# EAGLE design otamatone (EAGLE 8.6.3)
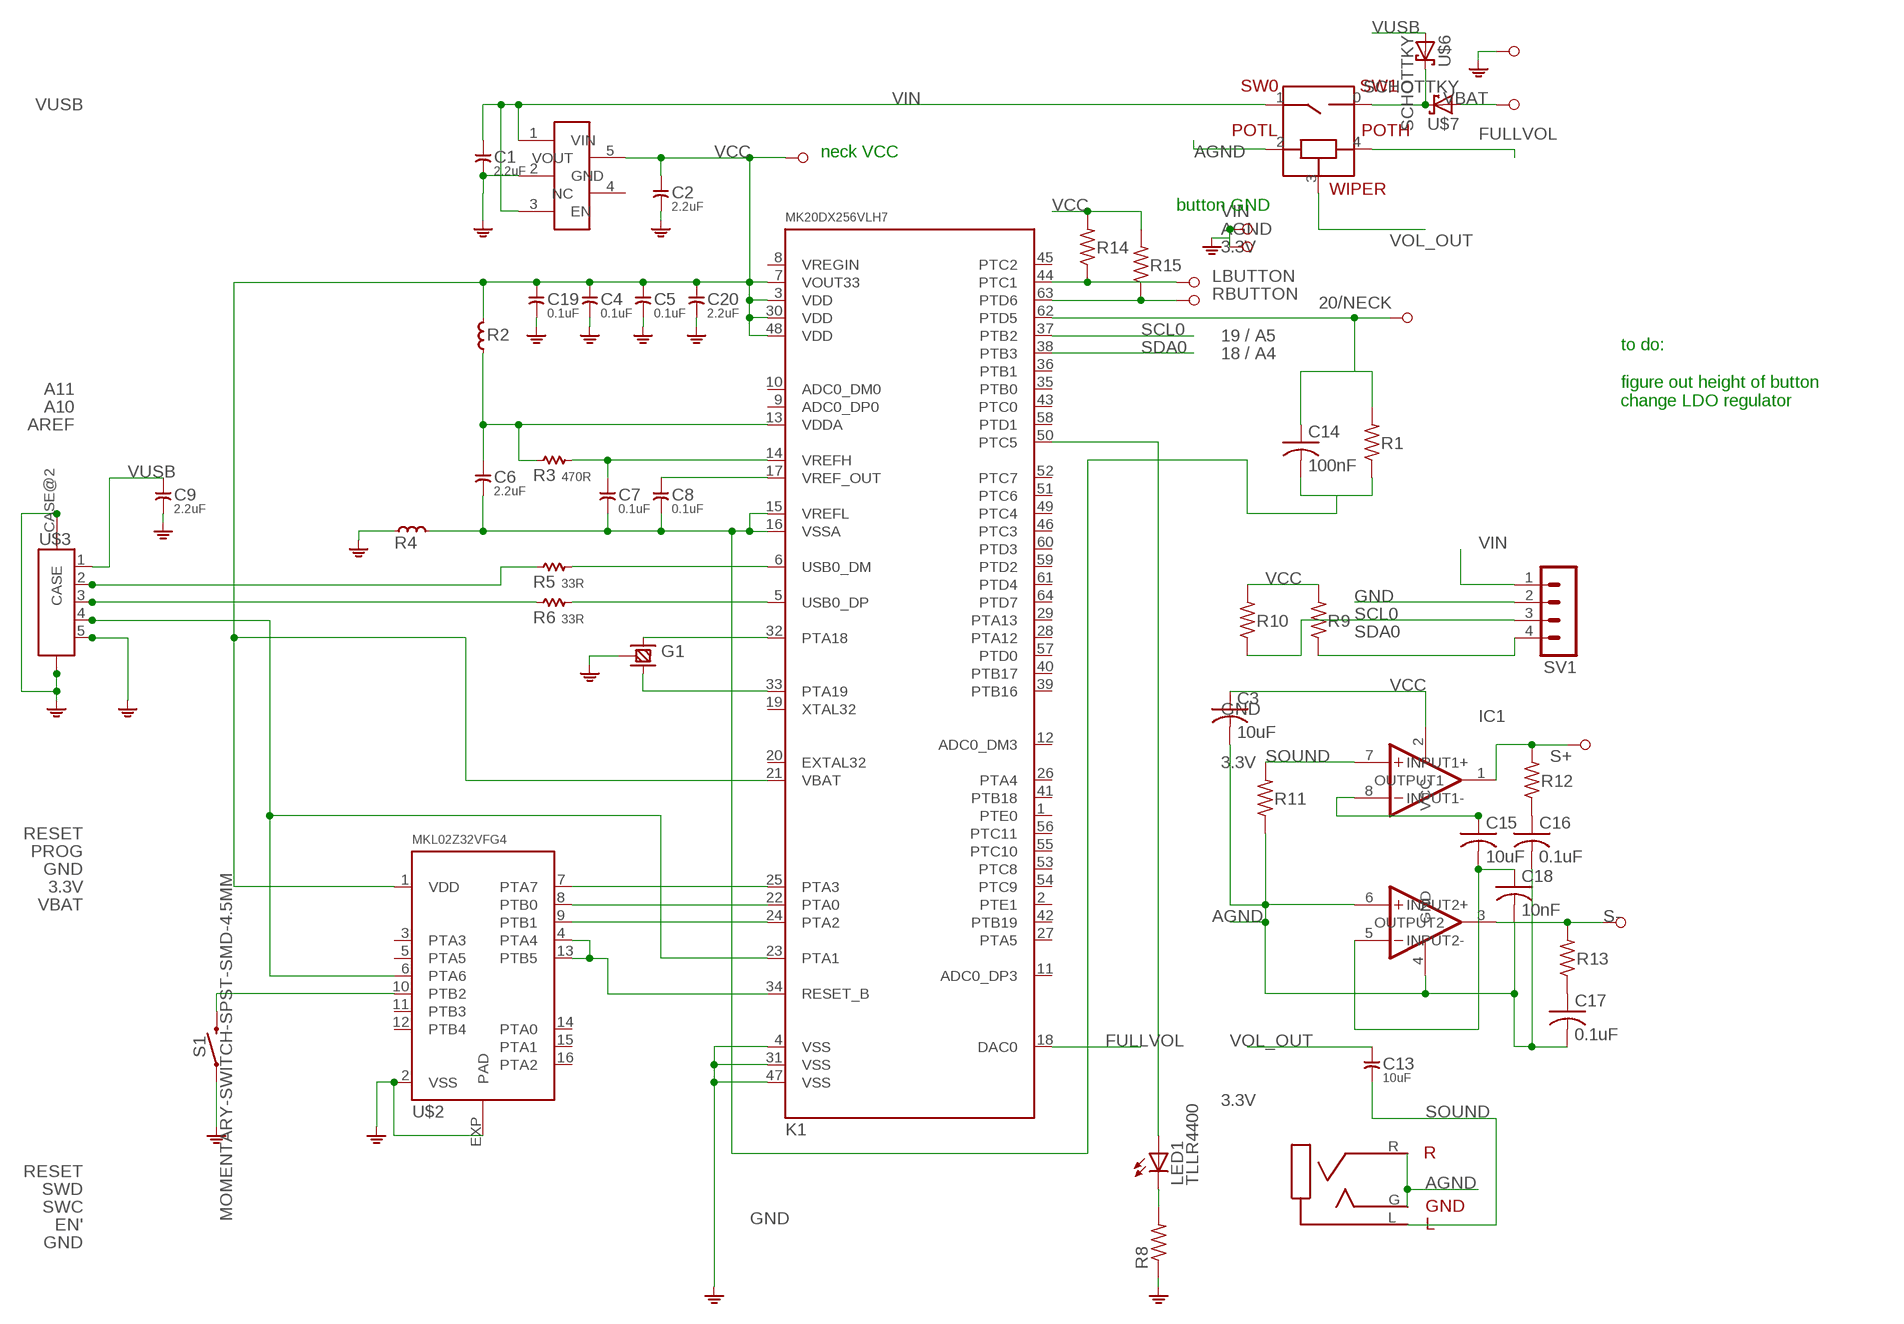
[diagram p0: schematic, sheet 1]

## Parts
B+  PIN  [PTH_39MIL]
B-  PIN  [PTH_39MIL]
C1  2.2uF  CAPACITOR-2.2UF  [C0603]
C2  2.2uF  CAPACITOR-2.2UF  [C0603]
C3  10uF  C-USC0603  [C0603]
C4  0.1uF  CAPACITOR-0.1UF  [C0402]
C5  0.1uF  CAPACITOR-0.1UF  [C0402]
C6  2.2uF  CAPACITOR-2.2UF  [C0603]
C7  0.1uF  CAPACITOR-0.1UF  [C0402]
C8  0.1uF  CAPACITOR-0.1UF  [C0402]
C9  2.2uF  CAPACITOR-2.2UF  [C0603]
C13  10uF  CAPACITOR-22PF  [C0603]
C14  100nF  C-USC0402  [C0402]
C15  10uF  C-USC0603  [C0603]
C16  0.1uF  C-USC0603  [C0603]
C17  0.1uF  C-USC0603  [C0603]
C18  10nF  C-USC0603  [C0603]
C19  0.1uF  CAPACITOR-0.1UF  [C0402]
C20  2.2uF  CAPACITOR-2.2UF  [C0603]
G1  CRYSTAL-  [CRYS]
IC1  TDA2822MSOP8  [SOP8]
K1  MK20DX256VLH7  [LQFP64-05]
LED1  TLLR4400  [LED3MM]
R1  62K  R-US_R0402  [R0402]
R2  FERRITE  [L0603]
R3  470R  RESISTOR-470R  [R0402]
R4  FERRITE  [L0603]
R5  33R  RESISTOR-33R  [R0402]
R6  33R  RESISTOR-33R  [R0402]
R8  R-US_R0603  [R0603]
R9  10K  R-US_R0402  [R0402]
R10  10K  R-US_R0402  [R0402]
R11  10K  R-US_R0603  [R0603]
R12  4.7  R-US_R0603  [R0603]
R13  4.7  R-US_R0603  [R0603]
R14  10K  R-US_R0402  [R0402]
R15  10K  R-US_R0402  [R0402]
S1  MOMENTARY-SWITCH-SPST-SMD-4.5MM  [TACTILE_SWITCH_SMD_4.5MM]
S+  PINSMT  [SMD]
S-  PINSMT  [SMD]
SV1  MA04-1  [MA04-1]
SX1  PIN  [PTH_39MIL]
SX2  PIN  [PTH_39MIL]
SX3  PIN  [PTH_39MIL]
SX4  PIN  [PTH_39MIL]
U$1  P170S  [5PIN_POT]
U$2  MKL02Z32VFG4  [QFN16]
U$3  VERT_USB  [TALL_BOI]
U$4  VERT_JACK  [AUDIOJACK]
U$5  AP2112K  [SOT25]
U$6  SCHOTTKY  [LED-0805]
U$7  SCHOTTKY  [LED-0805]
Z+  PINSMT  [SMD]
Z-  PINSMT  [SMD]

## Nets
20/NECK: C14.1 K1.62(PTD5) R1.2 Z-.P$1
AGND: C3.2 C6.2 C7.2 C8.2 C14.2 C16.2 C17.2 C18.2 IC1.4(GND) IC1.6(INPUT2+) K1.15(VREFL) K1.16(VSSA) R1.1 R4.2 R11.1 U$1.2(POTL) U$4.G(GND) U$4.R
FULLVOL: K1.18(DAC0) U$1.4(POTH)
GND: B-.1 C1.2 C2.2 C4.2 C5.2 C9.2 C19.2 C20.2 G1.P$1(GND) G1.P$4(GND) K1.4(VSS) K1.31(VSS) K1.47(VSS) R4.1 R8.1 S1.2 S1.3 SV1.2 SX1.1 SX3.1 U$2.2(VSS) U$2.EXP(PAD) U$3.5 U$3.CASE U$3.CASE@2(CASE) U$5.2(GND)
LBUTTON: K1.44(PTC1) R14.1 SX2.1
N$1: U$1.0(SW1) U$6.-(C) U$7.-(C)
N$2: K1.22(PTA0) U$2.8(PTB0)
N$3: K1.24(PTA2) U$2.9(PTB1)
N$5: G1.P$2 K1.32(PTA18)
N$6: G1.P$3 K1.33(PTA19)
N$7: C15.1 IC1.8(INPUT1-)
N$8: K1.25(PTA3) U$2.7(PTA7)
N$9: S1.1 S1.4 U$2.10(PTB2)
N$11: C8.1 K1.17(VREF_OUT)
N$12: K1.34(RESET_B) U$2.4(PTA4) U$2.13(PTB5)
N$13: C7.1 K1.14(VREFH) R3.2
N$15: C6.1 K1.13(VDDA) R2.1 R3.1
N$18: C16.1 R12.1
N$19: K1.23(PTA1) U$2.6(PTA6) U$3.4
N$21: C17.1 R13.1
N$22: C15.2 C18.1 IC1.5(INPUT2-)
N$31: K1.50(PTC5) LED1.A
N$52: LED1.K(C) R8.2
RBUTTON: K1.63(PTD6) R15.1 SX4.1
S+: IC1.1(OUTPUT1) R12.2 S+.P$1
S-: IC1.3(OUTPUT2) R13.2 S-.P$1
SCL0: K1.37(PTB2) R10.1 SV1.3
SDA0: K1.38(PTB3) R9.1 SV1.4
SOUND: C13.2 IC1.7(INPUT1+) R11.2 U$4.L
USB0_DM: K1.6(USB0_DM) R5.2
USB0_DP: K1.5(USB0_DP) R6.2
USB_M: R5.1 U$3.2
USB_P: R6.1 U$3.3
VBAT: B+.1 U$7.+(A)
VCC: C2.1 C3.1 C4.1 C5.1 C19.1 C20.1 IC1.2(VCC) K1.3(VDD) K1.7(VOUT33) K1.21(VBAT) K1.30(VDD) K1.48(VDD) R2.2 R9.2 R10.2 R14.2 R15.2 U$2.1(VDD) U$5.5(VOUT) Z+.P$1
VIN: C1.1 SV1.1 U$1.1(SW0) U$5.1(VIN) U$5.3(EN)
VOL_OUT: C13.1 U$1.3(WIPER)
VUSB: C9.1 U$3.1 U$6.+(A)
Unconnected: K1.1(PTE0) K1.2(PTE1) K1.8(VREGIN) K1.9(ADC0_DP0) K1.10(ADC0_DM0) K1.11(ADC0_DP3) K1.12(ADC0_DM3) K1.19(XTAL32) K1.20(EXTAL32) K1.26(PTA4) K1.27(PTA5) K1.28(PTA12) K1.29(PTA13) K1.35(PTB0) K1.36(PTB1) K1.39(PTB16) K1.40(PTB17) K1.41(PTB18) K1.42(PTB19) K1.43(PTC0) K1.45(PTC2) K1.46(PTC3) K1.49(PTC4) K1.51(PTC6) K1.52(PTC7) K1.53(PTC8) K1.54(PTC9) K1.55(PTC10) K1.56(PTC11) K1.57(PTD0) K1.58(PTD1) K1.59(PTD2) K1.60(PTD3) K1.61(PTD4) K1.64(PTD7) U$2.3(PTA3) U$2.5(PTA5) U$2.11(PTB3) U$2.12(PTB4) U$2.14(PTA0) U$2.15(PTA1) U$2.16(PTA2) U$5.4(NC)

## Notes on the sheet
- VUSB
- neck VCC
- button GND | VIN
- AGND
- 3.3V
- 19 / A5
- 18 / A4
- A11
- A10
- to do:
  
  figure out height of button
  change LDO regulator
- AREF
- GND
- 3.3V
- RESET
- PROG
- GND
- 3.3V
- VBAT
- 3.3V
- RESET
- SWD
- SWC
- EN'
- GND

## Library data of the parts
B+ B- = t32_ref:PIN
C1 C2 C6 C9 C20 = otamatone:CAPACITOR-2.2UF
C3 C14-C18 = rcl:C-US: CAPACITOR, American symbol; SPICEPREFIX: C
C4 C5 C7 C8 C19 = otamatone:CAPACITOR-0.1UF
C13 = t32_ref:CAPACITOR-22PF; DESC: 22pF / 50VDC / C0G (NP0); MF: Vishay / Vitramon; MPN: VJ0603A220JXACW1BC; OC_MOUSER: 77-VJ0603A220JXACBC; PACKAGE: 0603; TYPE: Capacitor; VALUE: 22pF
G1 = otamatone:CRYSTAL-
IC1 = TDA2822M:TDA2822M: TDA2822M - DUAL LOW-VOLTAGE POWER AMPLIFIER
K1 = t32_ref:MK20DX256VLH7; DESC: MK20DX256VLH7; MF: NXP; MPN: MK20DX256VLH7; OC_MOUSER: 841-MK20DX256VLH7; PACKAGE: LQFP-64; TYPE: Microcontroller
LED1 = led:TLLR4400: Low Current (2mA) LED 3 mm Tinted Diffused Package color RED Source: Data sheet <http://www.farnell.com/datasheets/391100.pdf>; MF: VISHAY SEMICONDUCTOR; OC_FARNELL: 1612437
R1 R8-R15 = rcl:R-US_: RESISTOR, American symbol; SPICEPREFIX: R
R2 R4 = otamatone:FERRITE; DESC: 600R / 100MHz; MF: Murata Electronics; MPN: BLM18AG601SN1D; OC_MOUSER: 81-BLM11A601S; PACKAGE: 0603; TYPE: Ferrite
R3 = otamatone:RESISTOR-470R
R5 R6 = otamatone:RESISTOR-33R
S1 = SparkFun-Switches:MOMENTARY-SWITCH-SPST: Momentary Switch (Pushbutton) - SPST Normally-open (NO) SPST momentary switches (buttons, pushbuttons). Variants PTH-12MM - 12mm square, through-hole Momentary Pushbutton Switch - 12mm Square <https://www.sparkfun.com/products/9190> (COM-09190) PTH-6.0MM, PTH-6.0MM-KIT - 6.0mm square, through-hole Mini Pushbutton Switch <https://www.sparkfun.com/products/97> (COM-00097) KIT package intended for soldering kit's - only one side of pads' copper is exposed. PTH-RIGHT-ANGLE-KIT - Right-angle, through-hole Right Angle Tactile Button <https://www.sparkfun.com/products/10791> - Used on SparkFun BigTime Watch Kit <https://www.sparkfun.com/products/11734> SMD-12MM - 12mm square, surface-mount Tactile Button - SMD (12mm) <https://www.sparkfun.com/products/12993> (COM-12993) Used on SparkFun PicoBoard <https://www.sparkfun.com/products/11888> SMD-4.5MM - 4.5mm Square Trackball Switch Used on SparkFun Blackberry Trackballer Breakout <https://www.sparkfun.com/products/13169> SMD-4.6MMX2.8MM - 4.60mm x 2.80mm, surface mount Used on SparkFun SAMD21 Mini Breakout <https://www.sparkfun.com/products/13664> SMD-5.2MM, SMD-5.2-REDUNDANT - 5.2mm square, surface-mount Mini Pushbutton Switch - SMD <https://www.sparkfun.com/products/8720> (COM-08720) Used on Arduino Pro Mini <https://www.sparkfun.com/products/11114> REDUNDANT package connects both switch circuits together SMD-6.0X3.5MM - 6.0 x 3.5mm, surface mount Momentary Reset Switch SMD <https://www.sparkfun.com/products/8229> (COM-08229) SMD-6.2MM-TALL - 6.2mm square, surface mount Tactile Button - SMD (6mm) <https://www.sparkfun.com/products/12992> Used on SparkFun Digital Sandbox <https://www.sparkfun.com/products/12651> SMD-RIGHT-ANGLE - Right-angle, surface mount Used on SparkFun Block for Intel® Edison - Arduino <https://www.sparkfun.com/products/13036>; PROD_ID: SWCH-09213
S+ S- SX1-SX4 Z+ Z- = otamatone:PIN
SV1 = con-lstb:MA04-1: PIN HEADER; OC_FARNELL: unknown; OC_NEWARK: unknown
U$1 = otamatone:P170S
U$2 = otamatone:MKL02Z32VFG4
U$3 = otamatone:VERT_USB
U$4 = otamatone:VERT_JACK
U$5 = otamatone:AP2112K
U$6 U$7 = otamatone:SCHOTTKY

## Board
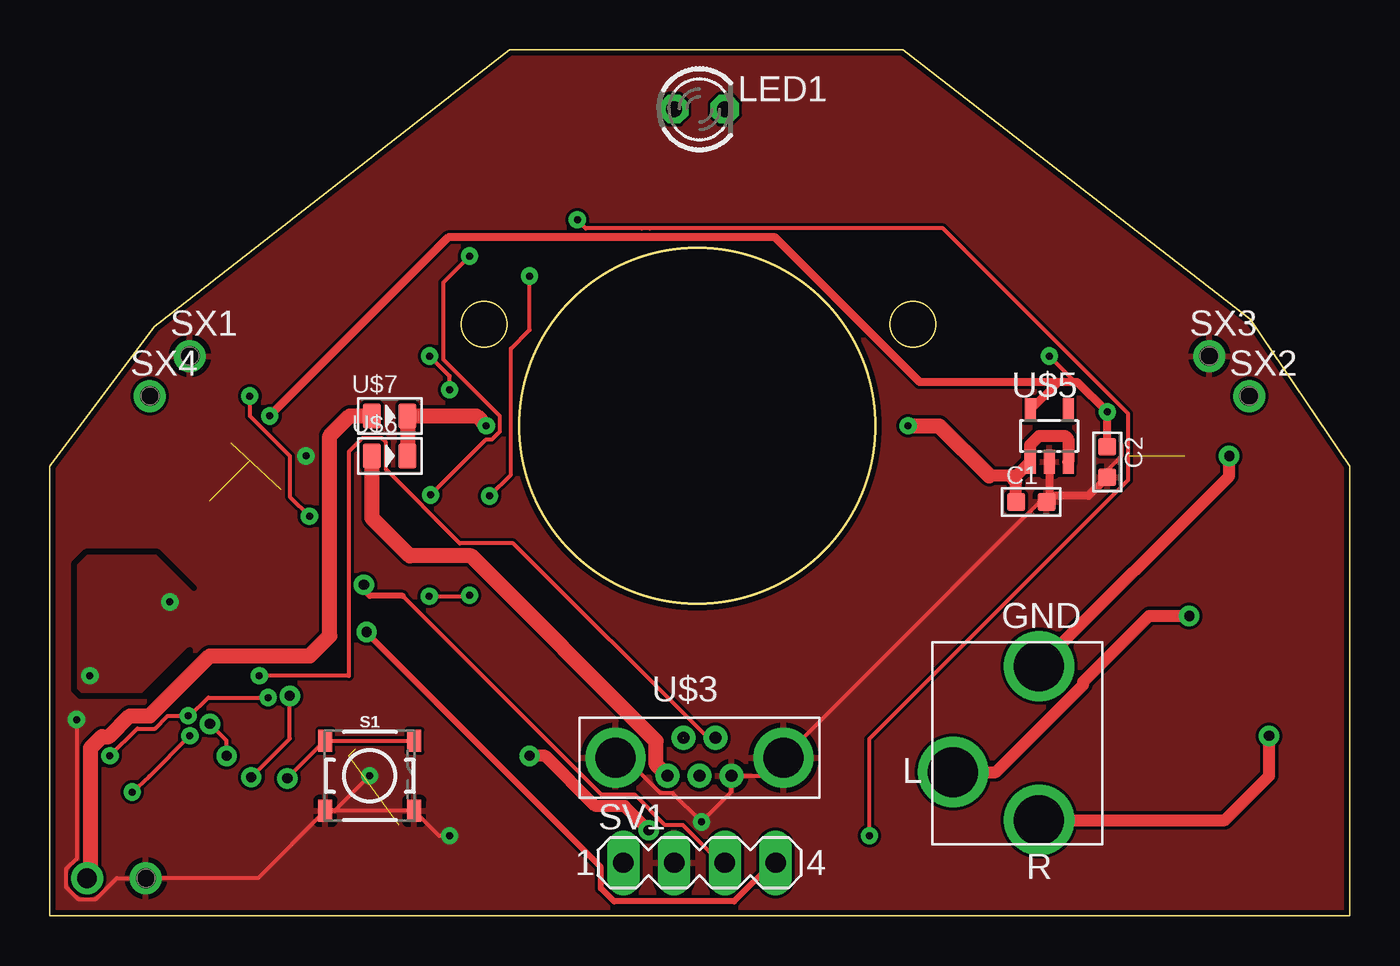
[diagram p1: board, top side]
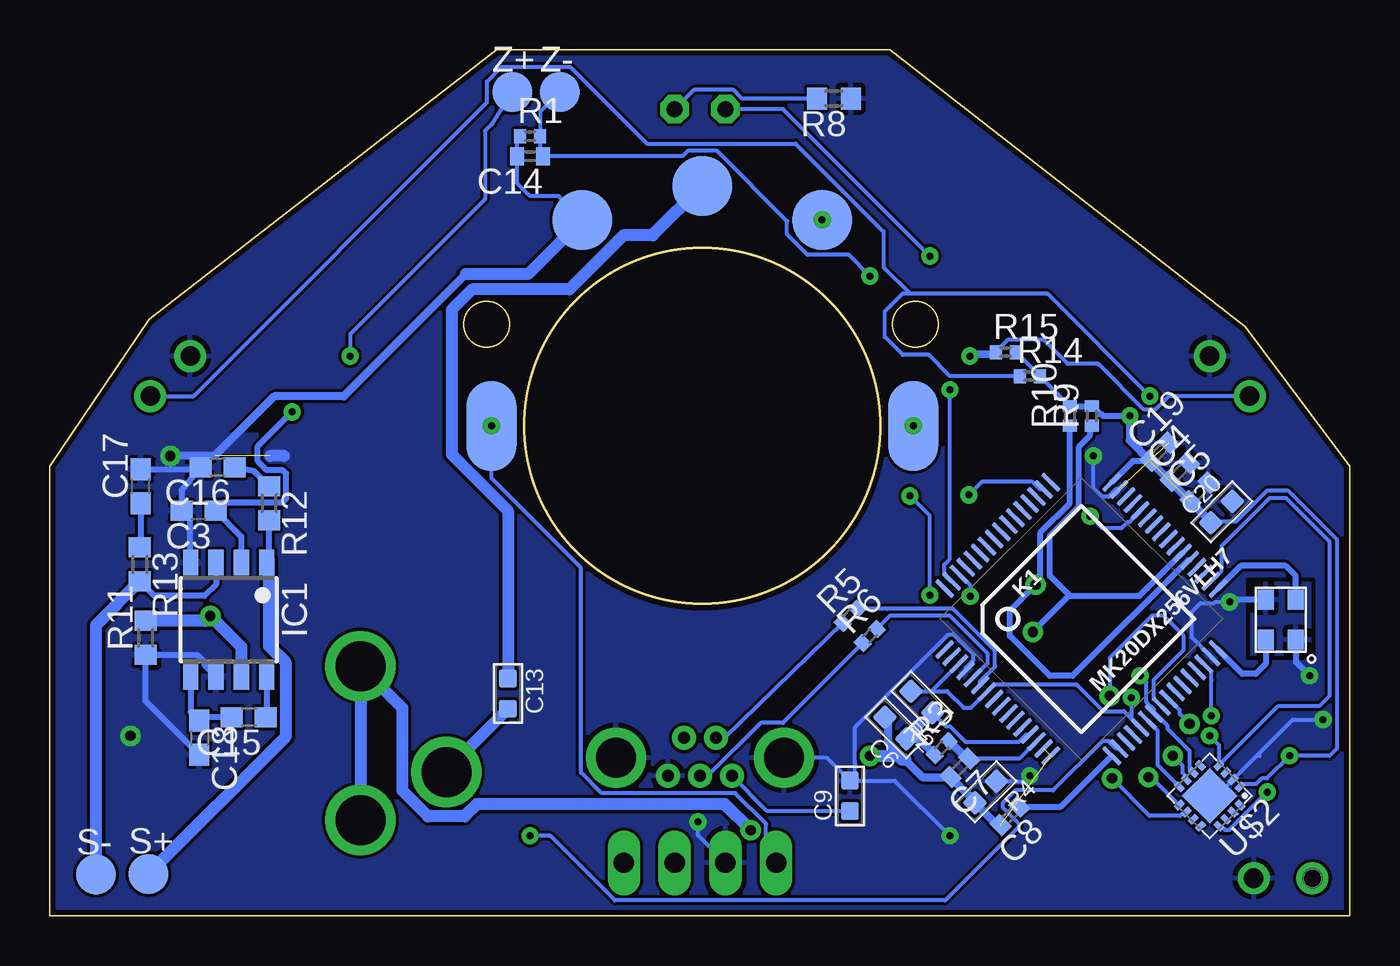
[diagram p2: board, bottom side, seen from below]

Size 65.02 x 43.31 mm. Coordinates in mm from the lower left corner, seen from the top.
Outline: 0,0 65.02,0 65.02,22.48 60.07,29.84 42.67,43.31 22.99,43.31 5.21,29.46 0,22.48 0,0
Outline: circle at 32.38,24.51 radius 8.9
Outline: circle at 21.72,29.59 radius 1.14
Outline: circle at 43.18,29.59 radius 1.14
Copper layers (1*16): Top 0.035mm / dielectric 1.5mm / Bottom 0.035mm
Design rules "SparkFun *": minimum track width 8mil, minimum drill 20mil, track to track 6mil, track to pad 6mil, pad to pad 6mil, via to via 6mil, smd to smd 6mil, copper to edge 10mil, drill to drill 8mil, minimum pad ring 12mil, minimum via ring 10mil, stop-mask expansion 4mil, vias tented up to drill 25mil, thermal gap 10mil
tKeepout: area 41,27.5 to 45.2,31.7; area 19.6,27.5 to 23.8,31.7; area 29.4,37.2 to 35.6,43.4
tRestrict: 7 lines
bRestrict: 4 lines

### Footprints (pad centres in the part's own frame; a part is rotated, then mirrored left to right if it is on the bottom)
PTH_39MIL = drill 0.991: 1 0,0
C0603 = smd 0.889 x 0.889: 1 0,0.762; 2 0,-0.762
C0603' = smd 1.1 x 1: 1 -0.85,0; 2 0.85,0
C0402 = smd 0.7 x 0.9: 1 -0.65,0; 2 0.65,0
CRYS = smd 1 x 0.8: P$1 0.6,0.5; P$2 2.6,0.5; P$3 0.6,2; P$4 2.593,2
SOP8 = smd 0.76 x 1.27: 1 -1.905,-2.86; 2 -0.635,-2.86; 3 0.635,-2.86; 4 1.905,-2.86; 5 1.905,2.86; 6 0.635,2.86; 7 -0.635,2.86; 8 -1.905,2.86
LQFP64-05 = smd 1.2 x 0.25: 1 -5.915,3.759; 2 -5.915,3.251; 3 -5.915,2.743; 4 -5.915,2.261; 5 -5.915,1.753; 6 -5.915,1.245; 7 -5.915,0.762; 8 -5.915,0.254; 9 -5.915,-0.254; 10 -5.915,-0.762; 11 -5.915,-1.245; 12 -5.915,-1.753; 13 -5.915,-2.261; 14 -5.915,-2.743; 15 -5.915,-3.251; 16 -5.915,-3.759; 33 5.915,-3.759; 34 5.915,-3.251; 35 5.915,-2.743; 36 5.915,-2.261; 37 5.915,-1.753; 38 5.915,-1.245; 39 5.915,-0.762; 40 5.915,-0.254; 41 5.915,0.254; 42 5.915,0.762; 43 5.915,1.245; 44 5.915,1.753; 45 5.915,2.261; 46 5.915,2.743; 47 5.915,3.251; 48 5.915,3.759 | smd 0.25 x 1.2: 17 -3.759,-5.915; 18 -3.251,-5.915; 19 -2.743,-5.915; 20 -2.261,-5.915; 21 -1.753,-5.915; 22 -1.245,-5.915; 23 -0.762,-5.915; 24 -0.254,-5.915; 25 0.254,-5.915; 26 0.762,-5.915; 27 1.245,-5.915; 28 1.753,-5.915; 29 2.261,-5.915; 30 2.743,-5.915; 31 3.251,-5.915; 32 3.759,-5.915; 49 3.759,5.915; 50 3.251,5.915; 51 2.743,5.915; 52 2.261,5.915; 53 1.753,5.915; 54 1.245,5.915; 55 0.762,5.915; 56 0.254,5.915; 57 -0.254,5.915; 58 -0.762,5.915; 59 -1.245,5.915; 60 -1.753,5.915; 61 -2.261,5.915; 62 -2.743,5.915; 63 -3.251,5.915; 64 -3.759,5.915
LED3MM = drill 0.813 octagon: A -1.27,0; K 1.27,0
R0402 = smd 0.6 x 0.7: 1 -0.5,0; 2 0.5,0
L0603 = smd 0.889 x 0.889: 1 -0.762,0; 2 0.762,0
R0603 = smd 1 x 1.1: 1 -0.85,0; 2 0.85,0
TACTILE_SWITCH_SMD_4.5MM = smd 0.7 x 1.1: 1 2.225,1.75; 2 2.225,-1.75; 3 -2.225,-1.75; 4 -2.225,1.75
SMD = smd 2 x 2: P$1 0,0
MA04-1 = drill 1.016 long: 1 -3.81,0; 2 -1.27,0; 3 1.27,0; 4 3.81,0
5PIN_POT = smd 2.5 x 4.5 bottom: 0 10.554,0; 1 -10.554,0 | smd 3 x 3 bottom: 2 -6,-10.3; 3 0,-12; 4 6,-10.3
QFN16 = smd 0.5 x 0.3: 1 -1.4,0.75; 2 -1.4,0.25; 3 -1.4,-0.25; 4 -1.4,-0.75; 9 1.4,-0.75; 10 1.4,-0.25; 11 1.4,0.25; 12 1.4,0.75 | smd 0.3 x 0.5: 5 -0.75,-1.4; 6 -0.25,-1.4; 7 0.25,-1.4; 8 0.75,-1.4; 13 0.75,1.4; 14 0.25,1.4; 15 -0.25,1.4; 16 -0.75,1.4 | smd 1.95 x 1.95: EXP 0,0
TALL_BOI = drill 0.6: 1 -1.6,-1.9; 2 -0.8,0; 3 0,-1.9; 4 0.8,0; 5 1.6,-1.9 | drill 2: CASE -4.2,-1; CASE@2 4.2,-1
AUDIOJACK = drill 2.5 pad 3.5: G 0.844,4.411; L -3.456,-0.889; R 0.844,-3.289
SOT25 = smd 0.55 x 1.2: 1 -0.95,-1.3; 2 0,-1.3; 3 0.95,-1.3; 4 0.95,1.3; 5 -0.95,1.3
LED-0805 = smd 0.889 x 1.27: + -0.889,0; - 0.889,0

### Placement (x,y rotation side)
B+  1.85,1.88 0 bottom
B-  4.8,1.88 0 top
C1  49.1,20.7 90 top
C2  52.9,22.7 0 top
C3  10uF  [C0603']  57.59,20.26 180 bottom
C4  8.5,22.2 45 bottom
C5  7.5,21.2 45 bottom
C6  22.7,9.4 225 bottom
C7  19.5,7.4 225 bottom
C8  17,5 225 bottom
C9  25,6 180 bottom
C13  42.11,11.12 0 bottom
C14  41,38 180 bottom
C15  10uF  [C0603']  55.07,9.94 180 bottom
C16  0.1uF  [C0603']  56.64,22.44 180 bottom
C17  0.1uF  [C0603']  60.48,21.48 90 bottom
C18  10nF  [C0603']  57.55,8.9 270 bottom
C19  9.5,23.2 45 bottom
C20  6.4,20.2 135 bottom
G1  4.7,16.4 270 bottom
IC1  56.08,14.81 180 bottom
K1  13.42,14.85 45 bottom
LED1  32.5,40.35 0 top
R1  41,39 0 bottom
R2  21.4,10.7 135 bottom
R3  20.4,8.4 45 bottom
R4  18.2,6.2 225 bottom
R5  25,15 45 bottom
R6  24,14 45 bottom
R8  25.81,40.88 180 bottom
R9  12.9,25 90 bottom
R10  14,25 90 bottom
R11  60.24,13.91 90 bottom
R12  54.06,20.64 270 bottom
R13  60.52,17.58 270 bottom
R14  16,27 0 bottom
R15  17.2,28.2 0 bottom
S1  16,7 0 top
S+  60.1,2.1 0 bottom
S-  62.72,2.06 0 bottom
SV1  32.5,2.65 0 top
SX1  7,28 0 top
SX2  60,26 0 top
SX3  58,28 0 top
SX4  5,26 0 top
U$1  32.38,24.51 180 top
U$2  7,6 225 bottom
U$3  32.5,8.9 0 top
U$4  48.64,8.08 0 top
U$5  50,24 0 top
U$6  17,23 0 top
U$7  17,25 0 top
Z+  41.9,41.2 0 bottom
Z-  39.51,41.2 0 bottom

### Tracks (layer width: path | path; a pad name or v marks a point on that pad's centre or on a via)
20/NECK  (via drill 0.35)
  Top 0.203: v18.98,15.98 20.94,15.98 v21,16.04 | v22,21 23.07,22.07 23.07,28.37 24,29.3 v24,32
  Bottom 0.203: Z-.P$1 40.5,40.21 R1.2 40.5,38.15 C14.1 33.38,38 33.11,38.27 31.66,38.27 28.14,34.75 28.14,34.08 27.11,33.06 25.06,33.06 v24,32 | K1.62 18.98,16.53 v18.98,15.98 | v21,16.04 21,20 v22,21
AGND  (via drill 0.51)  (3 unrouted)
  Top 0.61: U$4.G 59,22 v59,23 | U$4.R 58.79,4.79 61,7 v61,9 | v29.96,4.28 28.75,5.49 27.3,5.49 24.79,8 v24,8
  Bottom 0.203: R1.1 41.65,38.85 C14.2 41.65,36.65 41,36 39.57,36 U$1.2
  Bottom 0.305: C17.2 57.58,22.33 C16.2 58.44,21.29 C3.2 58,19.82 IC1.4 | IC1.6 57.3,12.53 57.3,12.71 57.65,13.06 R11.1 60.24,10.74 C18.2
  Bottom 0.406: C8.2 17.62,4.54 R4.2 18.74,5.72 C7.2 21.37,6.94 22.22,7.78 23.1,8.67 23.1,9.8 C6.2 | v59,23 56.78,23 53.8,25.98 50.33,25.98 44.22,32.09
  Bottom 0.61: U$4.R U$4.G 47.4,10.4 47.4,6.27 46.11,4.97 44.27,4.97 43.66,5.58 31.26,5.58 v29.96,4.28 | U$1.2 41.1,32.09 44.22,32.09 | 53.31,23 54,23 | v24,8 22.57,8 22.4,7.82 22.25,7.82 22.22,7.78
  pour Bottom: 53,24 62,24 62,7 53,7
FULLVOL  (via drill 0.35)
  Top 0.203: v41,4 41,8.86 53.95,21.81 53.95,25.11 44.68,34.39 30,34.39 29.61,34.39 26.81,34.39 v26.39,34.81
  Bottom 0.203: K1.18 11.68,8.37 12.06,8.74 12.37,8.74 14.83,6.28 16.72,6.28 17.36,5.64 17.36,5.42 16.57,4.64 16.57,4.43 20.23,0.77 36.75,0.77 39.98,4 v41,4
GND  (via drill 0.35)  (1 unrouted)
  Top 0.203: 53.6,23.6 53.6,22.98 52.9,22.28 C2.2 | v1.33,9.82 1.33,2.85 0.8,2.32 0.8,1.45 1.42,0.83 2.29,0.83 3.34,1.88 B-.1 10.41,1.88 S1.3 14.25,5.25 | U$3.CASE 28.79,7.9 30.54,6.14 31.16,6.14 v32.6,4.7 34.1,6.2 U$3.5 35.8,7 U$3.CASE@2 48.8,20 48.82,20 49.52,20.7 C1.2 | v20,4 19.48,4 S1.2 14.25,5.25 | v16,7 14.25,5.25
  Top 0.406: U$5.2 50,21 | 50,21 50,20.84 C1.2 | C2.2 51.96,21 50,21
  Bottom 0.203: C9.2 26.14,7.9 U$3.CASE | K1.31 7.9,13.92 7.9,15.2 7.46,15.64 6.78,15.64 6.72,15.7 v6,15.7 | U$2.2 6.65,6 U$2.EXP | 4.5,8 4.65,8 U$2.2 | U$2.2 2.83,9.82 v1.33,9.82 | K1.47 11.68,21.33 12.06,20.95 12.37,20.95 12.81,21.39 v12.81,23 | SV1.2 32.6,4.02 v32.6,4.7 | C9.2 22.76,6.76 v20,4 | K1.4 19.2,12.41 18.81,12.8 18.81,13.08 19.79,14.06 20.11,14.06 24.76,9.4 24.76,7 C9.2 | R4.1 16.26,6.74 v16,7
  Bottom 0.305: G1.P$4 2.7,12.7 v2,12 | G1.P$1 5.9,15.8 v6,15.7
  pour Top: 88,37 83,32 83,-14 78,-9 -5,-9 -11,-3 -11,44 72,44 75,47
  pour Bottom: 73,56 73,-19 -24,-19 -31,-12 -31,48 -18,61
LBUTTON  (via drill 0.35)
  Top 0.203: v10,26 10,25 12,23 12,20.96 v12.98,19.98
  Bottom 0.203: R14.1 20,27 21.05,28.05 22.35,28.05 23.25,28.95 23.25,30.23 22.35,31.13 22,31.13 | 22,31.13 15.13,31.13 v10,26 | v12.98,19.98 12.4,19.4 11.4,19.4 11.1,19.7 11,19.7 10.48,20.22 K1.44 | SX2.1 57.84,26 43.15,40.68 43.15,41.72 42.42,42.46 38.99,42.46 35.16,38.62 27.71,38.62 23.32,34.22 23.32,32.45 22,31.13
N$1  (via drill 0.35)
  Top 0.762: U$6.- U$7.- 21.34,25 U$1.0
  other vias: 21.83,24.51
N$2
  Bottom 0.203: U$2.8 9.6,7.54 9.6,9.26 K1.22
N$3  (via drill 0.51)
  Top 0.203: v10.07,6.93 12,8.86 v12,11
  Bottom 0.203: U$2.9 9.91,6.93 v10.07,6.93 | v12,11 12,12.9 9.9,15 9.3,15 8.3,14 8.3,13.3 9.8,11.8 9.8,10.86 K1.24
N$5
  Bottom 0.305: G1.P$2 4.2,12.6 4.7,12.1 5.36,12.1 K1.32
N$6
  Bottom 0.305: G1.P$3 2.7,17 3.2,17.5 5.45,17.5 K1.33
N$7
  Bottom 0.305: IC1.8 54.18,9.99 C15.1
N$8  (via drill 0.51)
  Top 0.203: v8.84,8 8.84,8.76 v8,9.6
  Bottom 0.203: U$2.7 8.17,6.95 8.35,7.13 8.35,7.51 v8.84,8 | v8,9.6 8.5,10.1 8.5,10.28 K1.25
N$9  (via drill 0.51)
  Top 0.203: v11.88,6.88 13.75,8.75 S1.4 S1.1
  Bottom 0.203: U$2.10 8.3,5.19 8.49,5 10.01,5 v11.88,6.88
N$11
  Bottom 0.305: C8.1 14.44,5.46 K1.17
N$12  (via drill 0.35)
  Top 0.203: v4.11,6.19 4.99,6.99 v7,9
  Bottom 0.203: K1.34 6.4,17.27 6.4,18.5 4,20.9 3.2,20.9 1,18.7 1,11 1.5,10.5 3.56,10.5 U$2.4 6.54,8.54 v7,9 | U$2.13 6.41,4.48 6.22,4.3 6.01,4.3 4.61,5.69 v4.11,6.19
N$13
  Bottom 0.203: K1.14 16.53,7.86 C7.1
  Bottom 0.406: R3.2 19.15,7.86 C7.1
N$15
  Bottom 0.203: K1.13 16.19,9.07 16.57,8.69 19.2,8.69 19.98,9.47 20.17,9.47 R2.1
  Bottom 0.406: R2.1 C6.1 21.57,8.86 R3.1
N$18
  Bottom 0.305: R12.1 54.81,22.24 C16.1
N$19  (via drill 0.35)
  Top 0.203: U$3.4 32.91,8.9 23.18,18.64 20.5,18.64 16.81,22.32 16.81,23.68 16.6,23.89 15.63,23.89 14.95,23.21 14.95,12 v10.48,12
  Bottom 0.203: U$2.6 8,7.35 8,8.24 9.1,9.34 9.1,9.5 9.72,10.12 K1.23 9.78,10.31 10.15,10.68 10.15,11.68 v10.48,12
N$21
  Bottom 0.305: C17.1 60.48,18.47 R13.1
N$22
  Bottom 0.305: C15.2 57.36,9.94 C18.1 57.99,10.19 IC1.5
N$31  (via drill 0.35)
  Top 0.203: v19.05,21.05 21.83,23.83 22.11,23.83 22.51,24.23 22.51,24.99 19.68,27.82 19.68,31.68 v21,33
  Bottom 0.203: K1.50 15.49,21.33 15.87,21.7 18.4,21.7 v19.05,21.05 | v21,33 28.34,40.34 LED1.A
N$52
  Bottom 0.203: R8.2 30.4,40.88 30.83,41.31 32.8,41.31 LED1.K
RBUTTON  (via drill 0.35)
  Top 0.203: v20,26.32 20,27 v19,28
  Bottom 0.203: v20,26.32 20,17.84 20.28,17.56 20.28,17.11 K1.63 | R15.1 18.8,28.2 v19,28 17.91,28 17.11,28.8 15.29,28.8 14.1,27.6 12.57,27.6 10.28,25.32 9.72,25.32 9.03,26 SX4.1
S+
  Bottom 0.305: IC1.1 54.06,17.79 R12.2
  Bottom 0.61: 54.06,17.79 54.06,13.49 53.22,12.65 53.22,8.99 S+.P$1
S-
  Bottom 0.305: IC1.3 56.72,16.58 57.3,16 59.8,16 R13.2
  Bottom 0.61: S-.P$1 62.72,14.53 R13.2
SCL0  (via drill 0.51)
  Top 0.203: 17.65,16 27.6,6.04 29.27,6.04 30.78,4.53 31.67,4.53 33.55,2.65 SV1.3
  Top 0.305: 17.65,16 16,16 15.71,16.29 v15.71,16.56
  Bottom 0.305: K1.37 8.07,17.79 13.86,12 15,12 17,14 17,15.27 v15.71,16.56 15.46,16.81 15.46,19.19 14,20.65 R10.1
SDA0  (via drill 0.51)
  Top 0.305: SV1.4 36.16,2.65 34.23,0.72 28.23,0.72 27.57,1.38 27.57,2.43 16,14 16,14.04 v15.84,14.2
  Bottom 0.305: R9.1 13,24 13.54,23.46 13.54,20.46 15,19 15,17 14,16 | K1.38 10.51,16 14,16 | v15.84,14.2 14.04,16 14,16
SOUND  (via drill 0.51)
  Top 0.61: U$4.L 47.32,7.19 51.7,11.57 51.7,11.7 55,15 v57,15
  Bottom 0.61: C13.2 45.19,7.27 U$4.L | IC1.7 55.45,13.45 v57,15 57.24,14.76 R11.2
USB0_DM
  Bottom 0.203: R5.2 23.15,15.35 23.15,15.36 19.85,15.36 17.74,13.25 17.74,12.47 18.48,11.73 K1.6
USB0_DP
  Bottom 0.203: K1.5 18.1,12.65 18.1,13.1 20,15 23,15 R6.2
USB_M  (1 unrouted)
  Bottom 0.203: R5.1 31.3,8.88 31.7,8.88
USB_P
  Bottom 0.203: R6.1 28.35,9.65 29.46,9.65 32.12,7 U$3.3
VBAT
  Top 0.762: U$7.+ 15,25 14,24 14,14 13,13 8,13 5,10 4,10 2.96,8.96 2.6,8.96 2.04,8.4 2.04,2.07 B+.1
VCC  (via drill 0.35)  (2 unrouted)
  Top 0.203: v10.91,10.92 7.92,10.92 7,10 6.92,10 | 6.92,10 v6.91,10.01 | v3,8 4.37,9.37 5.26,9.37 5.9,10 6.92,10 | v50,28 51.3,26.7 51.4,26.7
  Top 0.406: C2.1 v52.9,25.2 51.4,26.7 50.45,26.7 | 50.45,26.7 U$5.5 | 50.45,26.7 43.52,26.7 36.29,33.93 19.93,33.93 v11,25
  Bottom 0.203: v10.91,10.92 10.91,9.86 | 10.91,9.86 K1.21 | 10.91,9.86 11.29,10.24 12.32,10.24 13.66,11.58 17.77,11.58 K1.7 18.95,10.4 19.3,10.4 20.14,11.24 20.91,11.24 | C3.1 56.59,20.41 | Z+.P$1 42.9,39.61 43.25,39.26 43.25,35.85 50,29.1 v50,28 | 6.94,19.72 5.68,19.72 4.15,21.26 3.05,21.26 0.64,18.85 0.64,8.36 1,8 v3,8 4.13,6.87 4.4,6.87 4.67,6.59 5.34,6.59 U$2.1 | R2.2 20.91,11.24 | 20.91,11.24 K1.3 | v6.91,10.01 6.91,11.79 6.91,12.21 K1.30 | R10.2 R14.2 15.95,27.45 16.09,27.6 16.1,27.6 R15.2
  Bottom 0.305: R10.2 R9.2 12.51,25.11 12.42,25.11 12.32,25 v11,25 | IC1.2 55.45,18.97 C3.1 56.32,20.68 53.38,20.68 53.2,20.86 53.2,22.11 53.38,22.29 54.18,22.29 54.62,22.74 54.62,23.48 v52.9,25.2 | C19.1 10.85,22.74 K1.48
  Bottom 0.406: C20.1 6.94,19.72 C19.1 11,23.78 v11,25
VIN  (via drill 0.35)
  Top 0.61: 48,22 48.35,22 U$5.1 49.05,23.55 49.5,24 50.8,24 50.95,23.85 U$5.3 | 48,22 47,22 | C1.1 48.34,21.66 48,22
  Top 0.762: U$1.1 44.49,24.51 47,22
  Bottom 0.203: U$1.1 42.94,21.89 38.45,17.4 38.45,7.17 37.42,6.14 30.74,6.14 29.2,4.59 29.2,3.16 SV1.1
  other vias: 42.94,24.51
VOL_OUT
  Bottom 0.61: U$1.3 34.87,34.03 36.33,34.03 39.03,31.33 43.9,31.33 44.92,30.31 44.92,23.08 42.11,20.27 C13.1
VUSB
  Top 0.762: U$3.1 30.33,7.57 30.33,8.74 21.08,18 18,18 16.11,19.89 U$6.+
  Bottom 0.203: C9.1 29.14,5.24 U$3.1